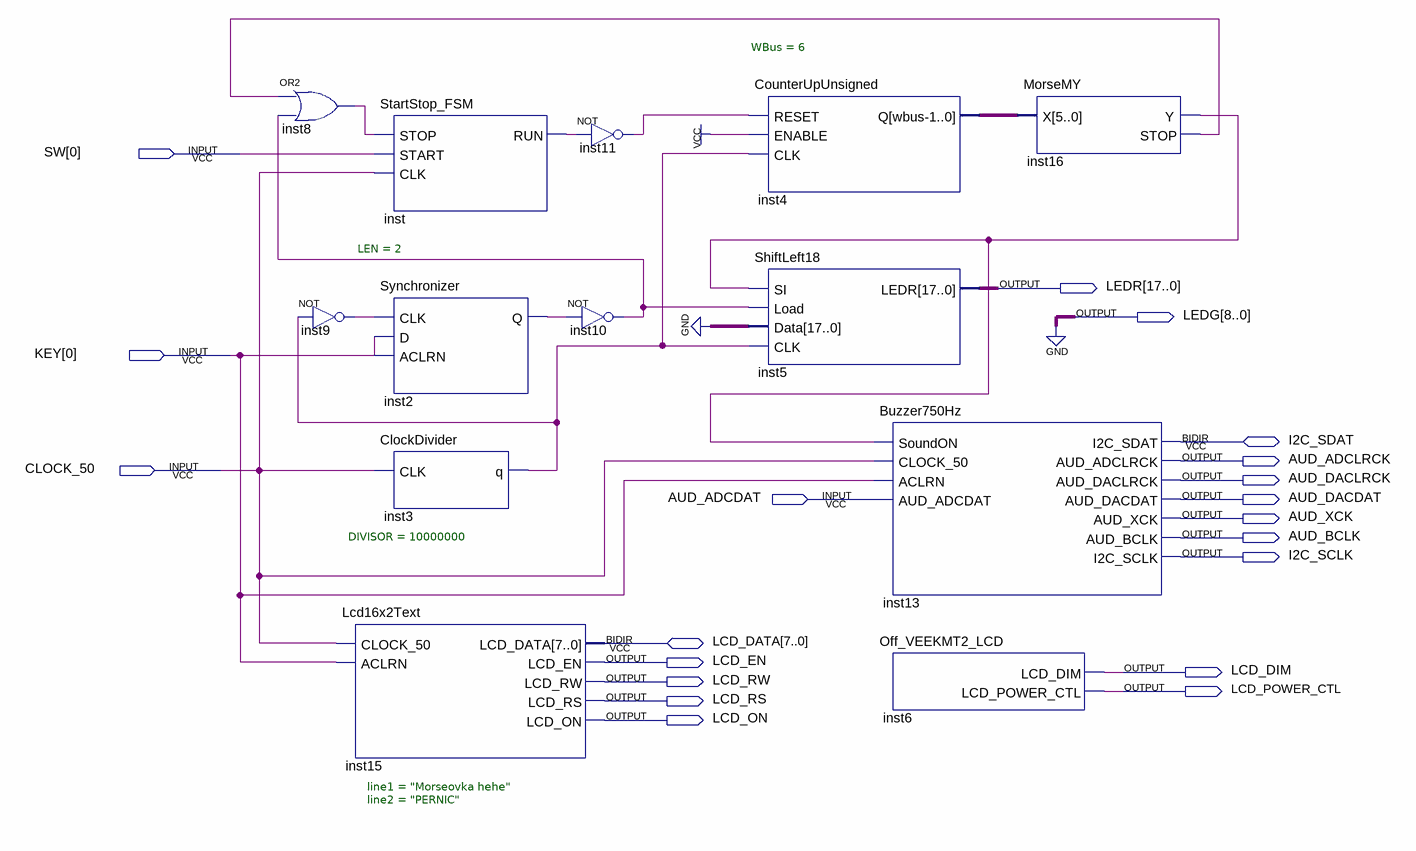
[diagram p0: schematic sheet]
// Quartus schematic morse_my.bdf as structural Verilog: 13 symbols, 20 pins
module morse_my (
  input  [0:0] SW,
  input  [0:0] KEY,
  input  CLOCK_50,
  input  AUD_ADCDAT,
  inout  I2C_SDAT,
  inout  [7:0] LCD_DATA,
  output [17:0] LEDR,
  output [8:0] LEDG,
  output AUD_ADCLRCK,
  output AUD_DACLRCK,
  output AUD_DACDAT,
  output AUD_XCK,
  output AUD_BCLK,
  output I2C_SCLK,
  output LCD_EN,
  output LCD_DIM,
  output LCD_RW,
  output LCD_POWER_CTL,
  output LCD_RS,
  output LCD_ON
);

  wire inst2_q, inst3_q, inst8_out, inst9_out, inst10_out, inst11_out, inst16_stop, inst16_y, inst_run;
  wire [5:0] inst4_q;

  or inst8 (inst8_out, inst16_stop, inst10_out);
  not inst9 (inst9_out, inst3_q);
  Lcd16x2Text #(.line1("Morseovka hehe"), .line2("PERNIC")) inst15 (
    .CLOCK_50(CLOCK_50), .ACLRN(KEY[0]), .LCD_EN(LCD_EN), .LCD_RW(LCD_RW), .LCD_RS(LCD_RS), .LCD_ON(LCD_ON),
    .LCD_DATA(LCD_DATA));
  StartStop_FSM inst (.STOP(inst8_out), .START(SW[0]), .CLK(CLOCK_50), .RUN(inst_run));
  Synchronizer #(.LEN(2)) inst2 (.CLK(inst9_out), .D(KEY[0]), .ACLRN(KEY[0]), .Q(inst2_q));
  ClockDivider #(.DIVISOR(10000000)) inst3 (.CLK(CLOCK_50), .q(inst3_q));
  not inst11 (inst11_out, inst_run);
  not inst10 (inst10_out, inst2_q);
  CounterUpUnsigned #(.WBus(6)) inst4 (.RESET(inst11_out), .ENABLE(1'b1), .CLK(inst3_q), .Q(inst4_q));
  ShiftLeft18 inst5 (.SI(inst16_y), .Load(inst10_out), .Data({18{1'b0}}), .CLK(inst3_q), .LEDR(LEDR));
  Buzzer750Hz inst13 (
    .SoundON(inst16_y), .CLOCK_50(CLOCK_50), .ACLRN(KEY[0]), .AUD_ADCDAT(AUD_ADCDAT),
    .AUD_ADCLRCK(AUD_ADCLRCK), .AUD_DACLRCK(AUD_DACLRCK), .AUD_DACDAT(AUD_DACDAT), .AUD_XCK(AUD_XCK),
    .AUD_BCLK(AUD_BCLK), .I2C_SCLK(I2C_SCLK), .I2C_SDAT(I2C_SDAT));
  Off_VEEKMT2_LCD inst6 (.LCD_DIM(LCD_DIM), .LCD_POWER_CTL(LCD_POWER_CTL));
  MorseMY inst16 (.X(inst4_q), .Y(inst16_y), .STOP(inst16_stop));

  assign LEDG = {9{1'b0}};
endmodule
